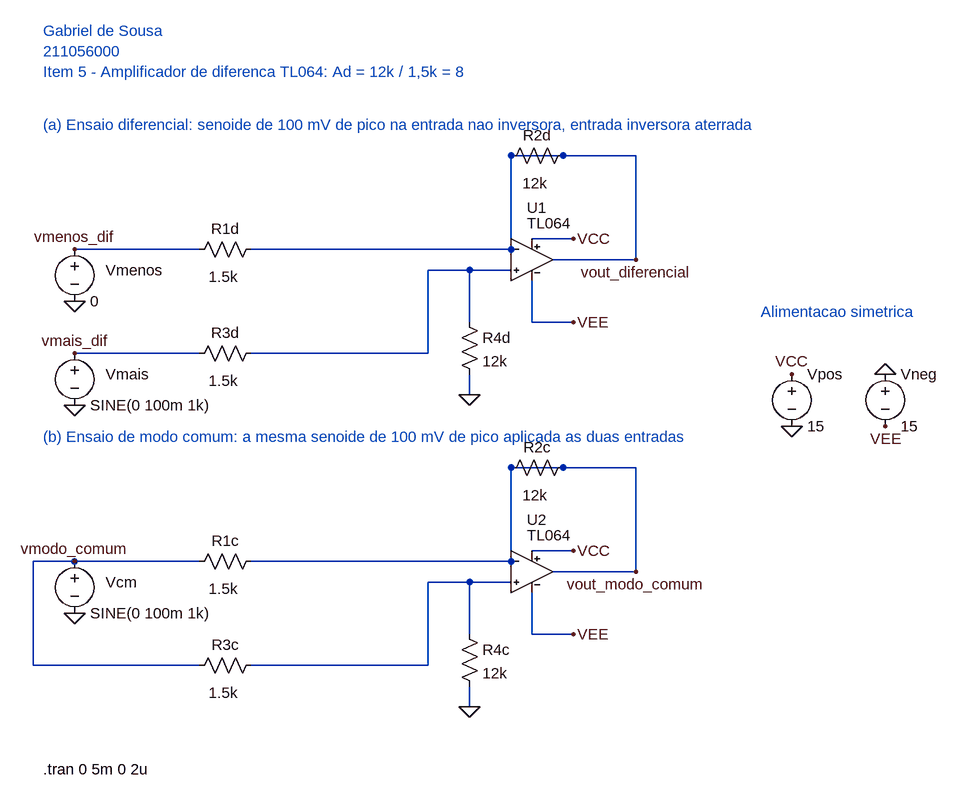
[diagram p0: schematic item_5.asc]
item_5.asc, the LTspice schematic file:
Version 4.1
SHEET 1 1500 1200
WIRE 96 288 288 288
WIRE 368 288 768 288
WIRE 768 144 768 288
WIRE 768 144 848 144
WIRE 848 144 960 144
WIRE 960 144 960 304
WIRE 960 304 832 304
WIRE 96 448 288 448
WIRE 368 448 640 448
WIRE 640 448 640 320
WIRE 640 320 768 320
WIRE 704 320 704 400
WIRE 704 480 704 512
WIRE 800 272 864 272
WIRE 800 336 800 400
WIRE 800 400 864 400
WIRE 32 768 96 768
WIRE 96 768 288 768
WIRE 368 768 768 768
WIRE 768 624 768 768
WIRE 768 624 848 624
WIRE 848 624 960 624
WIRE 960 624 960 784
WIRE 960 784 832 784
WIRE 32 768 32 928
WIRE 32 928 288 928
WIRE 368 928 640 928
WIRE 640 928 640 800
WIRE 640 800 768 800
WIRE 704 800 704 880
WIRE 704 960 704 992
WIRE 800 752 864 752
WIRE 800 816 800 880
WIRE 800 880 864 880
FLAG 96 288 vmenos_dif
FLAG 96 368 0
FLAG 96 448 vmais_dif
FLAG 96 528 0
FLAG 704 512 0
FLAG 864 272 VCC
FLAG 864 400 VEE
FLAG 960 304 vout_diferencial
FLAG 96 768 vmodo_comum
FLAG 96 848 0
FLAG 704 992 0
FLAG 864 752 VCC
FLAG 864 880 VEE
FLAG 960 784 vout_modo_comum
FLAG 1200 480 VCC
FLAG 1200 560 0
FLAG 1344 480 0
FLAG 1344 560 VEE
SYMBOL voltage 96 272 R0
WINDOW 0 48 48 Left 2
SYMATTR InstName Vmenos
SYMATTR Value 0
SYMBOL res 384 272 R90
WINDOW 0 0 56 VBottom 2
WINDOW 3 58 59 VCenter 2
SYMATTR InstName R1d
SYMATTR Value 1.5k
SYMBOL res 864 128 R90
WINDOW 0 0 56 VBottom 2
WINDOW 3 58 59 VCenter 2
SYMATTR InstName R2d
SYMATTR Value 12k
SYMBOL voltage 96 432 R0
WINDOW 0 48 48 Left 2
SYMATTR InstName Vmais
SYMATTR Value SINE(0 100m 1k)
SYMBOL res 384 432 R90
WINDOW 0 0 56 VBottom 2
WINDOW 3 58 59 VCenter 2
SYMATTR InstName R3d
SYMATTR Value 1.5k
SYMBOL res 688 384 R0
SYMATTR InstName R4d
SYMATTR Value 12k
SYMBOL item_7 800 240 R0
WINDOW 0 -8 -16 Left 2
WINDOW 3 -8 8 Left 2
SYMATTR InstName U1
SYMBOL voltage 96 752 R0
WINDOW 0 48 48 Left 2
SYMATTR InstName Vcm
SYMATTR Value SINE(0 100m 1k)
SYMBOL res 384 752 R90
WINDOW 0 0 56 VBottom 2
WINDOW 3 58 59 VCenter 2
SYMATTR InstName R1c
SYMATTR Value 1.5k
SYMBOL res 864 608 R90
WINDOW 0 0 56 VBottom 2
WINDOW 3 58 59 VCenter 2
SYMATTR InstName R2c
SYMATTR Value 12k
SYMBOL res 384 912 R90
WINDOW 0 0 56 VBottom 2
WINDOW 3 58 59 VCenter 2
SYMATTR InstName R3c
SYMATTR Value 1.5k
SYMBOL res 688 864 R0
SYMATTR InstName R4c
SYMATTR Value 12k
SYMBOL item_7 800 720 R0
WINDOW 0 -8 -16 Left 2
WINDOW 3 -8 8 Left 2
SYMATTR InstName U2
SYMBOL voltage 1200 464 R0
SYMATTR InstName Vpos
SYMATTR Value 15
SYMBOL voltage 1344 464 R0
SYMATTR InstName Vneg
SYMATTR Value 15
TEXT 48 -48 Left 2 ;Gabriel de Sousa\n211056000\nItem 5 - Amplificador de diferenca TL064: Ad = 12k / 1,5k = 8
TEXT 48 96 Left 2 ;(a) Ensaio diferencial: senoide de 100 mV de pico na entrada nao inversora, entrada inversora aterrada
TEXT 48 576 Left 2 ;(b) Ensaio de modo comum: a mesma senoide de 100 mV de pico aplicada as duas entradas
TEXT 1152 384 Left 2 ;Alimentacao simetrica
TEXT 48 1088 Left 2 !.tran 0 5m 0 2u

The netlist it stands for:
* item_5.asc
Vmenos vmenos_dif 0 0
R1d vout_diferencial vmenos_dif 1.5k
R2d vout_diferencial vout_diferencial 12k
Vmais vmais_dif 0 SINE(0 100m 1k)
R3d N001 vmais_dif 1.5k
R4d N001 0 12k
X§U1 vout_diferencial vout_diferencial N001 VCC VEE TL064  ; pins In- OUT In+ V+ V-
Vcm vmodo_comum 0 SINE(0 100m 1k)
R1c vout_modo_comum vmodo_comum 1.5k
R2c vout_modo_comum vout_modo_comum 12k
R3c N002 vmodo_comum 1.5k
R4c N002 0 12k
X§U2 vout_modo_comum vout_modo_comum N002 VCC VEE TL064  ; pins In- OUT In+ V+ V-
Vpos VCC 0 15
Vneg 0 VEE 15
* Gabriel de Sousa
* 211056000
* Item 5 - Amplificador de diferenca TL064: Ad = 12k / 1,5k = 8
* (a) Ensaio diferencial: senoide de 100 mV de pico na entrada nao inversora, entrada inversora aterrada
* (b) Ensaio de modo comum: a mesma senoide de 100 mV de pico aplicada as duas entradas
* Alimentacao simetrica
.tran 0 5m 0 2u
.lib ene0046.lib
.backanno
.end